# Altium schematic sheet v6_net.SchDoc: Virtex-6 Gigabit Ethernet
size A3; Date: DO NOT USE, RATHER USE PROJ OPTIONS; DrawnBy: DO NOT USE, RATHER USE PROJ OPTIONS; Engineer: DO NOT USE, RATHER USE PROJ OPTIONS; Organization: DO NOT USE, RATHER USE PROJ OPTIONS; DocumentNumber: DO NOT USE, RATHER USE PROJ OPTIONS; Revision: DO NOT USE, RATHER USE PROJ OPTIONS; SheetNumber: 23; SheetTotal: 29; SCH_Sheet_Filename: v6_net.SchDoc; CurrentTime: DO NOT USE, RATHER USE PROJ OPTIONS; Time: DO NOT USE, RATHER USE PROJ OPTIONS; DocumentFullPathAndName: DO NOT USE, RATHER USE PROJ OPTIONS; DocumentName: DO NOT USE, RATHER USE PROJ OPTIONS; ModifiedDate: DO NOT USE, RATHER USE PROJ OPTIONS; ImagePath: DO NOT USE, RATHER USE PROJ OPTIONS
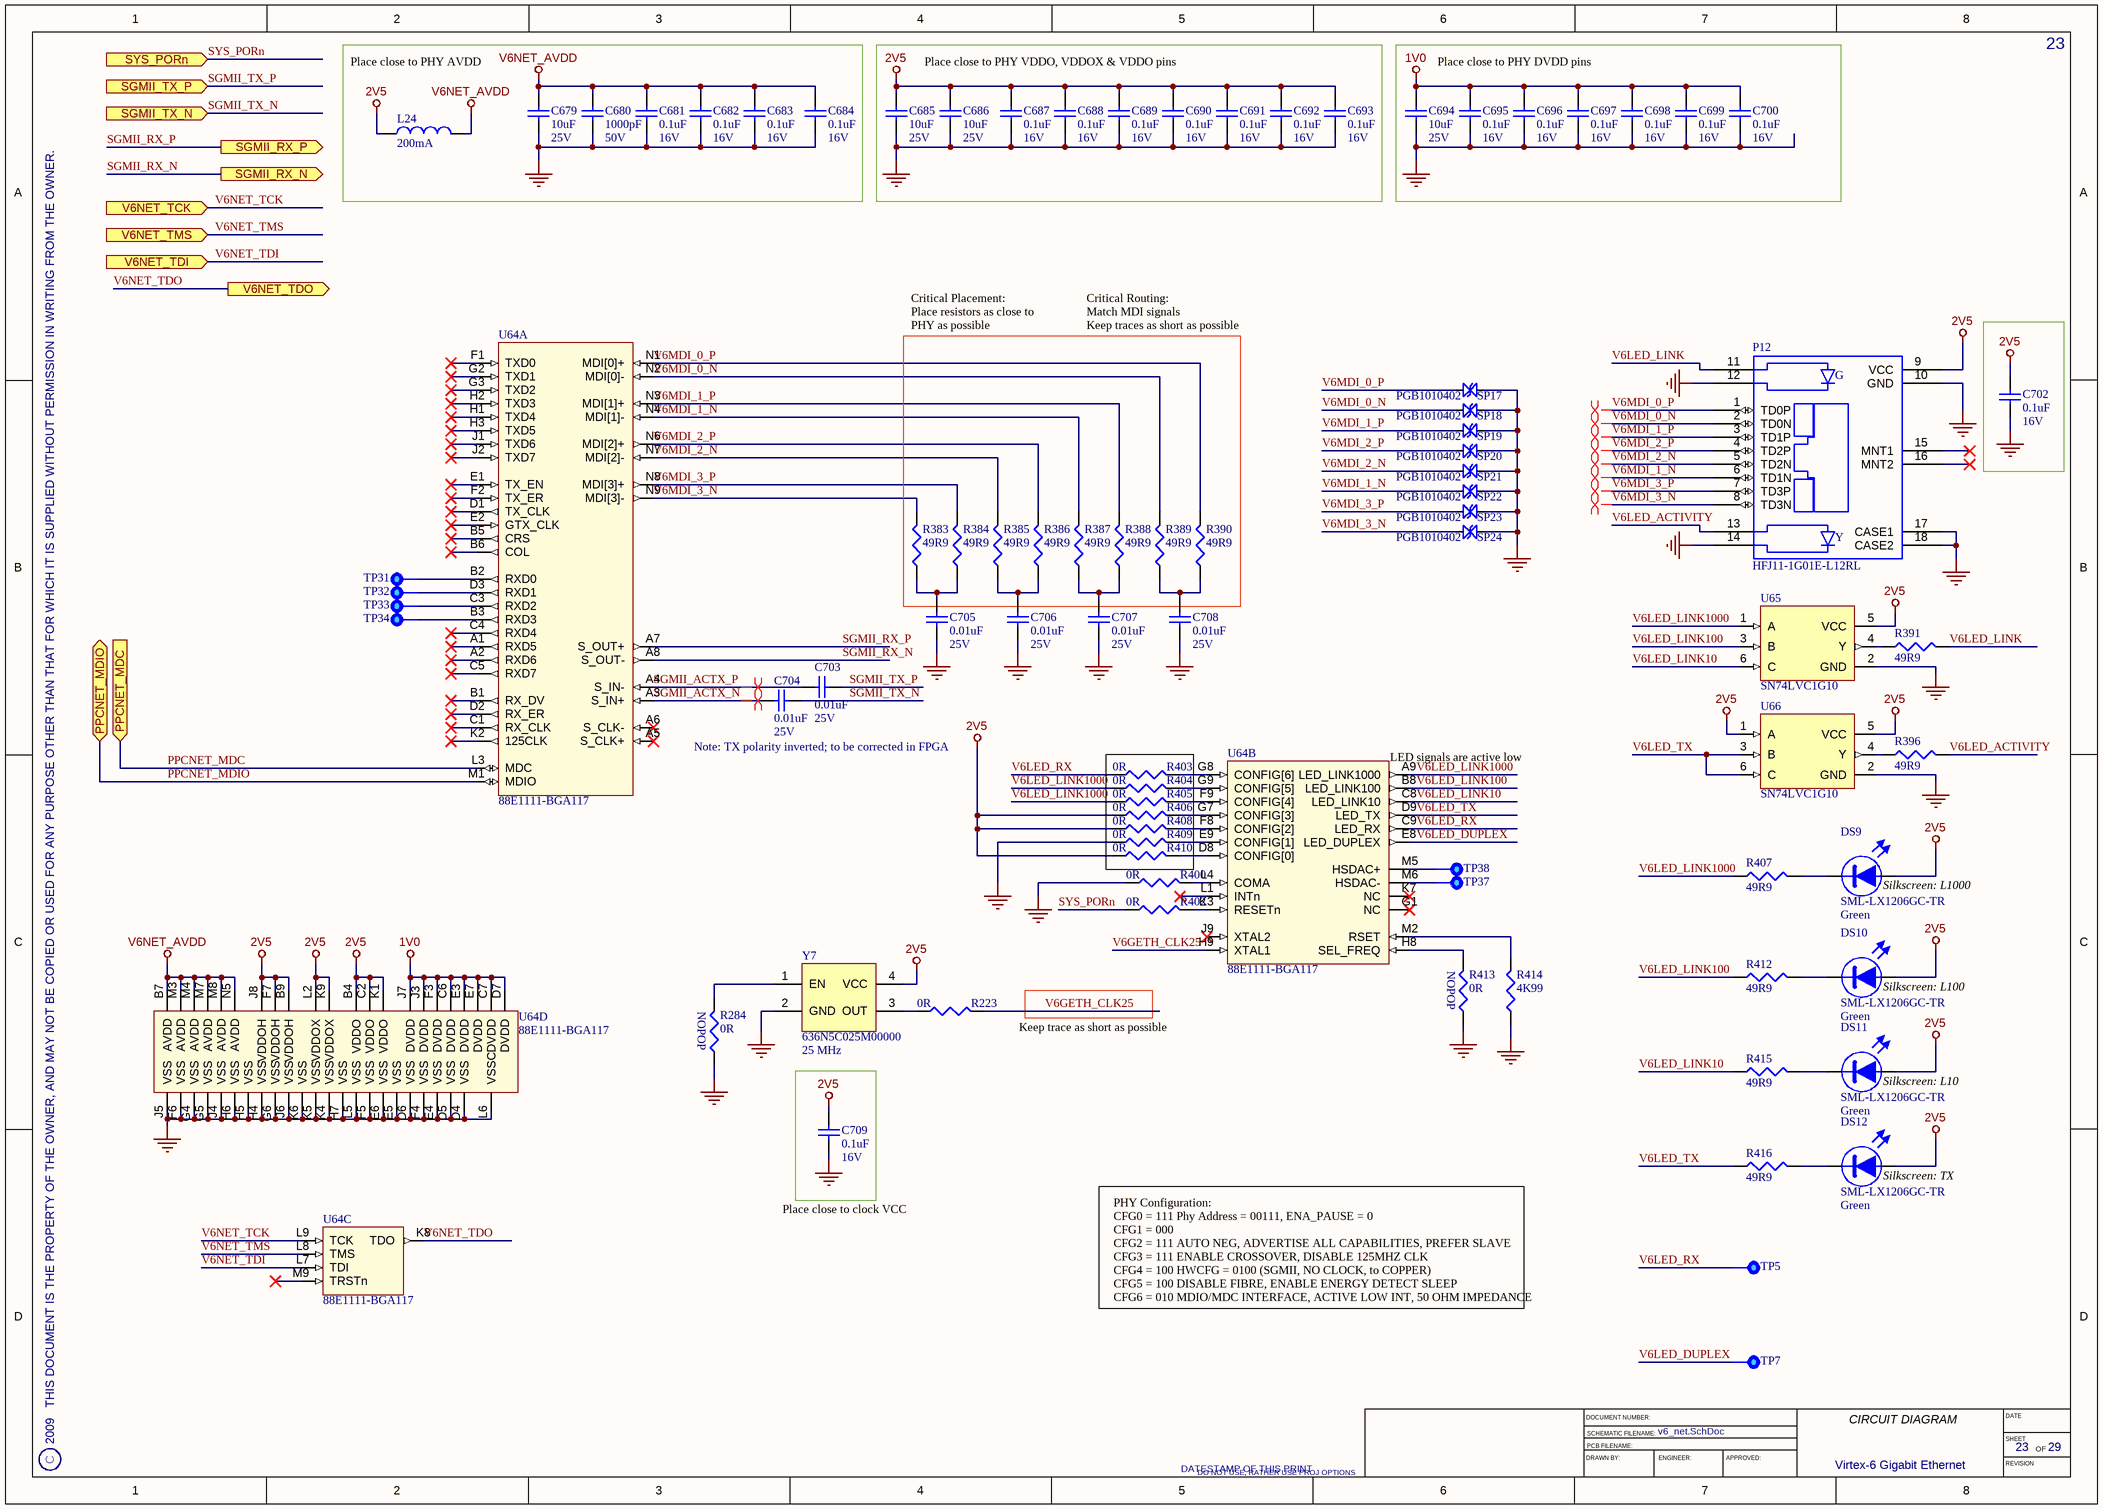
[diagram p0: v6_net.SchDoc]

## Parts
C679  Rating: 25V  [CAPC3225X200L]  (hidden comment: 10uF)
C680  Rating: 50V  [CAPC1005X55L]  (hidden comment: 1000pF)
C681  Rating: 16V  [CAPC1005X60L]  (hidden comment: 0.1uF)
C682  Rating: 16V  [CAPC1005X60L]  (hidden comment: 0.1uF)
C683  Rating: 16V  [CAPC1005X60L]  (hidden comment: 0.1uF)
C684  Rating: 16V  [CAPC1005X60L]  (hidden comment: 0.1uF)
C685  Rating: 25V  [CAPC3225X200L]  (hidden comment: 10uF)
C686  Rating: 25V  [CAPC3225X200L]  (hidden comment: 10uF)
C687  Rating: 16V  [CAPC1005X60L]  (hidden comment: 0.1uF)
C688  Rating: 16V  [CAPC1005X60L]  (hidden comment: 0.1uF)
C689  Rating: 16V  [CAPC1005X60L]  (hidden comment: 0.1uF)
C690  Rating: 16V  [CAPC1005X60L]  (hidden comment: 0.1uF)
C691  Rating: 16V  [CAPC1005X60L]  (hidden comment: 0.1uF)
C692  Rating: 16V  [CAPC1005X60L]  (hidden comment: 0.1uF)
C693  Rating: 16V  [CAPC1005X60L]  (hidden comment: 0.1uF)
C694  Rating: 25V  [CAPC3225X200L]  (hidden comment: 10uF)
C695  Rating: 16V  [CAPC1005X60L]  (hidden comment: 0.1uF)
C696  Rating: 16V  [CAPC1005X60L]  (hidden comment: 0.1uF)
C697  Rating: 16V  [CAPC1005X60L]  (hidden comment: 0.1uF)
C698  Rating: 16V  [CAPC1005X60L]  (hidden comment: 0.1uF)
C699  Rating: 16V  [CAPC1005X60L]  (hidden comment: 0.1uF)
C700  Rating: 16V  [CAPC1005X60L]  (hidden comment: 0.1uF)
C702  Rating: 16V  [CAPC1005X60L]  (hidden comment: 0.1uF)
C703  Rating: 25V  [CAPC1005X55L]  (hidden comment: 0.01uF)
C704  Rating: 25V  [CAPC1005X55L]  (hidden comment: 0.01uF)
C705  Rating: 25V  [CAPC1005X55L]  (hidden comment: 0.01uF)
C706  Rating: 25V  [CAPC1005X55L]  (hidden comment: 0.01uF)
C707  Rating: 25V  [CAPC1005X55L]  (hidden comment: 0.01uF)
C708  Rating: 25V  [CAPC1005X55L]  (hidden comment: 0.01uF)
C709  Rating: 16V  [CAPC1005X60L]  (hidden comment: 0.1uF)
DS9  SML-LX1206GC-TR  Colour: Green  [LEDC3216X120N]
DS10  SML-LX1206GC-TR  Colour: Green  [LEDC3216X120N]
DS11  SML-LX1206GC-TR  Colour: Green  [LEDC3216X120N]
DS12  SML-LX1206GC-TR  Colour: Green  [LEDC3216X120N]
L24  Rating: 200mA  [INDC2012X130L]  (hidden comment: 600R)
P12  HFJ11-1G01E-L12RL  [HALO_HFJ11-1G02E-L55]
R223  0R  [RESC1005X40L]
R284  0R  [RESC1005X40L]
R383  49R9  [RESC1005X40L]
R384  49R9  [RESC1005X40L]
R385  49R9  [RESC1005X40L]
R386  49R9  [RESC1005X40L]
R387  49R9  [RESC1005X40L]
R388  49R9  [RESC1005X40L]
R389  49R9  [RESC1005X40L]
R390  49R9  [RESC1005X40L]
R391  49R9  [RESC1005X40L]
R396  49R9  [RESC1005X40L]
R400  0R  [RESC1005X40L]
R402  0R  [RESC1005X40L]
R403  0R  [RESC1005X40L]
R404  0R  [RESC1005X40L]
R405  0R  [RESC1005X40L]
R406  0R  [RESC1005X40L]
R407  49R9  [RESC1005X40L]
R408  0R  [RESC1005X40L]
R409  0R  [RESC1005X40L]
R410  0R  [RESC1005X40L]
R412  49R9  [RESC1005X40L]
R413  0R  [RESC1005X40L]
R414  4K99  [RESC1005X40L]
R415  49R9  [RESC1005X40L]
R416  49R9  [RESC1005X40L]
SP17  PGB1010402  [PGB1010402]
SP18  PGB1010402  [PGB1010402]
SP19  PGB1010402  [PGB1010402]
SP20  PGB1010402  [PGB1010402]
SP21  PGB1010402  [PGB1010402]
SP22  PGB1010402  [PGB1010402]
SP23  PGB1010402  [PGB1010402]
SP24  PGB1010402  [PGB1010402]
TP5  Testpoint  [TP100]  (value not drawn)  (no BOM)
TP7  Testpoint  [TP100]  (value not drawn)  (no BOM)
TP31  Testpoint  [TP100]  (value not drawn)  (no BOM)
TP32  Testpoint  [TP100]  (value not drawn)  (no BOM)
TP33  Testpoint  [TP100]  (value not drawn)  (no BOM)
TP34  Testpoint  [TP100]  (value not drawn)  (no BOM)
TP37  Testpoint  [TP100]  (value not drawn)  (no BOM)
TP38  Testpoint  [TP100]  (value not drawn)  (no BOM)
U64  88E1111-BGA117  [BGA117C100P13X9_1400X1000X154]  (parts A,B,C,D of 4)
U65  SN74LVC1G10  [SOT23-6]
U66  SN74LVC1G10  [SOT23-6]
Y7  Frequency: 25 MHz  [636XXXXXXMXXXXX]  (hidden comment: 636N5C025M00000)

## Ports
PPCNET_MDC (in), PPCNET_MDIO (bidir), SGMII_RX_N (out), SGMII_RX_P (out), SGMII_TX_N (in), SGMII_TX_P (in), SYS_PORn (in), V6NET_TCK (in), V6NET_TDI (in), V6NET_TDO (out), V6NET_TMS (in)

## Nets
1V0: C694.2 C695.2 C696.2 C697.2 C698.2 C699.2 C700.2 U64.C6(DVDD) U64.C7(DVDD) U64.D7(DVDD) U64.E3(DVDD) U64.E7(DVDD) U64.F3(DVDD) U64.J3(DVDD) U64.J7(DVDD)
2V5: C685.2 C686.2 C687.2 C688.2 C689.2 C690.2 C691.2 C692.2 C693.2 C702.2 C709.2 DS9.2(A) DS10.2(A) DS11.2(A) DS12.2(A) L24.1 P12.9(VCC) R406.1 R408.1 R410.1 U64.B4(VDDO) U64.B9(VDDOH) U64.C2(VDDO) U64.F7(VDDOH) U64.J8(VDDOH) U64.K1(VDDO) U64.K9(VDDOX) U64.L2(VDDOX) U65.5(VCC) U66.1(A) U66.5(VCC) Y7.4(VCC)
GND: C679.1 C680.1 C681.1 C682.1 C683.1 C684.1 C685.1 C686.1 C687.1 C688.1 C689.1 C690.1 C691.1 C692.1 C693.1 C694.1 C695.1 C696.1 C697.1 C698.1 C699.1 C700.1 C702.1 C705.2 C706.2 C707.2 C708.2 C709.1 P12.10(GND) P12.12(R1_YA_GC) P12.14(L1_YA_GC) P12.17(CASE1) P12.18(CASE2) R284.1 R400.1 R409.1 R413.1 R414.1 SP17.1(A) SP18.1(A) SP19.1(A) SP20.1(A) SP21.1(A) SP22.1(A) SP23.1(A) SP24.1(A) U64.D4(VSS) U64.D5(VSS) U64.D6(VSS) U64.E4(VSS) U64.E5(VSS) U64.E6(VSS) U64.F4(VSS) U64.F5(VSS) U64.F6(VSS) U64.G4(VSS) U64.G5(VSS) U64.G6(VSS) U64.H4(VSS) U64.H5(VSS) U64.H6(VSS) U64.H7(VSS) U64.J4(VSS) U64.J5(VSS) U64.J6(VSS) U64.K4(VSS) U64.K5(VSS) U64.K6(VSS) U64.L5(VSS) U64.L6(VSSC) U65.2(GND) U66.2(GND) Y7.2(GND)
V6NET_AVDD: C679.2 C680.2 C681.2 C682.2 C683.2 C684.2 L24.2 U64.B7(AVDD) U64.M3(AVDD) U64.M4(AVDD) U64.M7(AVDD) U64.M8(AVDD) U64.N5(AVDD)
PPCNET_MDC: U64.L3(MDC) ; port PPCNET_MDC
PPCNET_MDIO: U64.M1(MDIO) ; port PPCNET_MDIO
SGMII_ACTX_N: C704.2 U64.A3(S_IN+)
SGMII_ACTX_P: C703.2 U64.A4(S_IN-)
SGMII_RX_N: U64.A8(S_OUT-) ; port SGMII_RX_N
SGMII_RX_P: U64.A7(S_OUT+) ; port SGMII_RX_P
SGMII_TX_N: C704.1 ; port SGMII_TX_N
SGMII_TX_P: C703.1 ; port SGMII_TX_P
SYS_PORn: R402.1 ; port SYS_PORn
V6GETH_CLK25: R223.2 U64.H9(XTAL1)
V6LED_ACTIVITY: P12.13(L1_YC_GA) R396.2
V6LED_DUPLEX: TP7.1 U64.E8(LED_DUPLEX)
V6LED_LINK: P12.11(R1_YC_GA) R391.2
V6LED_LINK10: R415.1 U64.C8(LED_LINK10) U65.6(C)
V6LED_LINK100: R412.1 U64.B8(LED_LINK100) U65.3(B)
V6LED_LINK1000: R404.1 R405.1 R407.1 U64.A9(LED_LINK1000) U65.1(A)
V6LED_RX: R403.1 TP5.1 U64.C9(LED_RX)
V6LED_TX: R416.1 U64.D9(LED_TX) U66.3(B) U66.6(C)
V6MDI_0_N: P12.2(TD0N) R389.2 SP18.2(B) U64.N2(MDI[0]-)
V6MDI_0_P: P12.1(TD0P) R390.2 SP17.2(B) U64.N1(MDI[0]+)
V6MDI_1_N: P12.6(TD1N) R387.2 SP22.2(B) U64.N4(MDI[1]-)
V6MDI_1_P: P12.3(TD1P) R388.2 SP19.2(B) U64.N3(MDI[1]+)
V6MDI_2_N: P12.5(TD2N) R385.2 SP21.2(B) U64.N7(MDI[2]-)
V6MDI_2_P: P12.4(TD2P) R386.2 SP20.2(B) U64.N6(MDI[2]+)
V6MDI_3_N: P12.8(TD3N) R383.2 SP24.2(B) U64.N9(MDI[3]-)
V6MDI_3_P: P12.7(TD3P) R384.2 SP23.2(B) U64.N8(MDI[3]+)
V6NET_TCK: U64.L9(TCK) ; port V6NET_TCK
V6NET_TDI: U64.L7(TDI) ; port V6NET_TDI
V6NET_TDO: U64.K8(TDO) ; port V6NET_TDO
V6NET_TMS: U64.L8(TMS) ; port V6NET_TMS
NetC705_1: C705.1 R383.1 R384.1
NetC706_1: C706.1 R385.1 R386.1
NetC707_1: C707.1 R387.1 R388.1
NetC708_1: C708.1 R389.1 R390.1
NetDS9_1: DS9.1(K) R407.2
NetDS10_1: DS10.1(K) R412.2
NetDS11_1: DS11.1(K) R415.2
NetDS12_1: DS12.1(K) R416.2
NetR223_1: R223.1 Y7.3(OUT)
NetR284_2: R284.2 Y7.1(EN)
NetR391_1: R391.1 U65.4(Y)
NetR396_1: R396.1 U66.4(Y)
NetR400_2: R400.2 U64.L4(COMA)
NetR402_2: R402.2 U64.K3(RESETn)
NetR403_2: R403.2 U64.G8(CONFIG[6])
NetR404_2: R404.2 U64.G9(CONFIG[5])
NetR405_2: R405.2 U64.F9(CONFIG[4])
NetR406_2: R406.2 U64.G7(CONFIG[3])
NetR408_2: R408.2 U64.F8(CONFIG[2])
NetR409_2: R409.2 U64.E9(CONFIG[1])
NetR410_2: R410.2 U64.D8(CONFIG[0])
NetR413_2: R413.2 U64.H8(SEL_FREQ)
NetR414_2: R414.2 U64.M2(RSET)
NetTP31_1: TP31.1 U64.B2(RXD0)
NetTP32_1: TP32.1 U64.D3(RXD1)
NetTP33_1: TP33.1 U64.C3(RXD2)
NetTP34_1: TP34.1 U64.B3(RXD3)
NetTP37_1: TP37.1 U64.M6(HSDAC-)
NetTP38_1: TP38.1 U64.M5(HSDAC+)

Not connected (* = marked no-connect by the designer): P12 15(MNT1)* 16(MNT2)*; U64 A1(RXD5)* A2(RXD6)* A5(S_CLK+)* A6(S_CLK-)* B1(RX_DV)* B5(CRS)* B6(COL)* C1(RX_CLK)* C4(RXD4)* C5(RXD7)* D1(TX_CLK)* D2(RX_ER)* E1(TX_EN)* E2(GTX_CLK)* F1(TXD0)* F2(TX_ER)* G1(NC)* G2(TXD1)* G3(TXD2)* H1(TXD4)* H2(TXD3)* H3(TXD5)* J1(TXD6)* J2(TXD7)* J9(XTAL2)* K2(125CLK)* K7(NC)* L1(INTn)* M9(TRSTn)*

## Layout directives
differential pair: SGMII_ACTX_N, SGMII_ACTX_P, V6MDI_0_N, V6MDI_0_P, V6MDI_1_N, V6MDI_1_P, V6MDI_2_N, V6MDI_2_P, V6MDI_3_N, V6MDI_3_P

## Notes on the sheet
- Place close to PHY AVDD
- Place close to PHY VDDO, VDDOX & VDDO pins
- Place close to PHY DVDD pins
- Critical Placement:
  Place resistors as close to
  PHY as possible
- Critical Routing:
  Match MDI signals
  Keep traces as short as possible
- Note: TX polarity inverted; to be corrected in FPGA
- (near U64) LED signals are active low
- (near DS9) Silkscreen: L1000
- (near R413) NOPOP
- (near DS10) Silkscreen: L100
- (near R284) NOPOP
- (near R223) Keep trace as short as possible
- (near DS11) Silkscreen: L10
- (near DS12) Silkscreen: TX
- Place close to clock VCC
- PHY Configuration:
  CFG0 = 111 Phy Address = 00111, ENA_PAUSE = 0
  CFG1 = 000
  CFG2 = 111 AUTO NEG, ADVERTISE ALL CAPABILITIES, PREFER SLAVE
  CFG3 = 111 ENABLE CROSSOVER, DISABLE 125MHZ CLK
  CFG4 = 100 HWCFG = 0100 (SGMII, NO CLOCK, to COPPER)
  CFG5 = 100 DISABLE FIBRE, ENABLE ENERGY DETECT SLEEP
  CFG6 = 010 MDIO/MDC INTERFACE, ACTIVE LOW INT, 50 OHM IMPEDANCE
- 2009   THIS DOCUMENT IS THE PROPERTY OF THE OWNER, AND MAY NOT BE COPIED OR USED FOR ANY PURPOSE OTHER THAN THAT FOR WHICH IT IS SUPPLIED WITHOUT PERMISSION IN WRITING FROM THE OWNER.
- C
- DATESTAMP OF THIS PRINT
- DRAWN BY:
- DOCUMENT NUMBER:
- SCHEMATIC FILENAME:
- PCB FILENAME:
- ENGINEER:
- APPROVED:
- CIRCUIT DIAGRAM
- DATE
- SHEET
- REVISION
- OF
- (in symbol CONN-PCB-4) G

## Library data of the parts
C679 C685 C686 C694 = CAP-CER-5: 10uF, Ceramic Capacitor; Manufacturer: MURATA; PartNum: GRM32DR61E106KA12L; Tolerance: 10%; Dielectric: X5R; POD number: CAP-CER-5; Value: 10uF; RoHS: Y; Sort Value: 100; Category: Capacitors; Subcategory: Ceramic
C680 = CAP-CER-4: 1000pF, Ceramic Capacitor; Manufacturer: MURATA; PartNum: GRM155R61H102KA01D; Tolerance: 10%; Dielectric: X5R; POD number: CAP-CER-4; Value: 1000pF; RoHS: Y; Sort Value: 0.0001; Category: Capacitors; Subcategory: Ceramic
C681-C684 C687-C693 C695-C700 C702 C709 = CAP-CER-1: 0.1uF, Ceramic Capacitor; Manufacturer: VENKEL; PartNum: C0402X7R160-104KN; Tolerance: 10%; Dielectric: X7R; POD number: CAP-CER-1; Value: 0.1uF; RoHS: Y; Sort Value: 0.1; Category: Capacitors; Subcategory: Ceramic
C703-C708 = CAP-CER-6: 0.01uF, Ceramic Capacitor; Manufacturer: MURATA; PartNum: GRM155R71E103KA01D; Tolerance: 10%; Dielectric: X7R; POD number: CAP-CER-6; Value: 0.01uF; RoHS: Y; Sort Value: 0.01; Category: Capacitors; Subcategory: Ceramic
DS9-DS12 = OPTO-LED-0: Green, Surface mount, LED, 1206; Manufacturer: LUMEX; Vdrop: 2.2V; Rating: 20mA; POD number: OPTO-LED-0; PartNum: SML-LX1206GC-TR; RoHS: Y; Category: OPTO; Subcategory: LED
L24 = IND-FB-0: 600 Ohm, Chip Ferrite Bead; Manufacturer: Murata; PartNum: BLM21BD601SN1; DC Res: 0.35R; Tolerance: 25%; POD number: IND-FB-0; RoHS: Y; Value: 600R; Sort Value: 600; Category: Inductors; Subcategory: FerriteBead
P12 = CONN-PCB-4: RJ45 with Integrated magnetic and dual LEDs; Manufacturer: HALO; POD number: CONN-PCB-4; PartNum: HFJ11-1G01E-L12RL; RoHS: Y; Category: CONN; Subcategory: PCB
R223 R284 R400 R402-R406 R408-R410 R413 = RES-TF-0: 0R, 1.1mm x 0.5mm, Thick Film Resistor; Manufacturer: ROYALOHM; PartNum: 0402WG00000T1E; Tolerance: 0%; Rating: 0.0625W; POD number: RES-TF-0; Value: 0R; Sort Value: 0; Category: Resistors; Subcategory: ThickFilm; HelpURL: *.pdf
R383-R391 R396 R407 R412 R415 R416 = RES-TF-10: 49R9, 1.1mm x 0.5mm, Thick Film Resistor; Manufacturer: ROYALOHM; PartNum: 0402WGF499JT1E; Tolerance: 1%; Rating: 0.0625W; POD number: RES-TF-10; Value: 49R9; Sort Value: 49.9; Category: Resistors; Subcategory: ThickFilm; HelpURL: *.pdf
R414 = RES-TF-13: 4K99, 1.1mm x 0.5mm, Thick Film Resistor; Manufacturer: ROYALOHM; PartNum: 0402WGF4991T1E; Tolerance: 1%; Rating: 0.0625W; POD number: RES-TF-13; Value: 4K99; Sort Value: 4990; Category: Resistors; Subcategory: ThickFilm; HelpURL: *.pdf
SP17-SP24 = ELMECH-ESD-3: Surface Mount Polymeric ESD Suppressor in an 0402 package; POD number: ELMECH-ESD-3; PartNum: PGB1010402
TP5 TP7 TP31-TP34 TP37 TP38 = ELMECH-TP-0: 1mm Diameter, through-hole, Circular Test-point; POD number: ELMECH-TP-0; RoHS: Y; Category: ELMECH; Subcategory: Test Points
U64 = IC-PHY-1: Integrated 10/100/1000 Ultra Gigabit Ethernet Transceiver; Manufacturer: Marvell; PartNum: 88E1111-XX-BAB1C000; POD number: IC-PHY-1; RoHS: Y; Category: IC; Subcategory: Network PHY
U65 U66 = IC-LOG-3: Single 3-input Positive-NAND gate; Manufacturer: Texas Instruments; POD number: IC-LOG-3; PartNum: SN74LVC1G10; RoHS: Y; Category: IC; Subcategory: Logic
Y7 = RESN-CLK-5: 25.00 MHz, 2V5, CTS 636 clock oscillator; Stability: 50 PPM; POD number: RESN-CLK-5; PartNum: 636N5C025M00000; Manufacturer: CTS; RoHS: Y; Category: RESN; Subcategory: Clock Oscillators